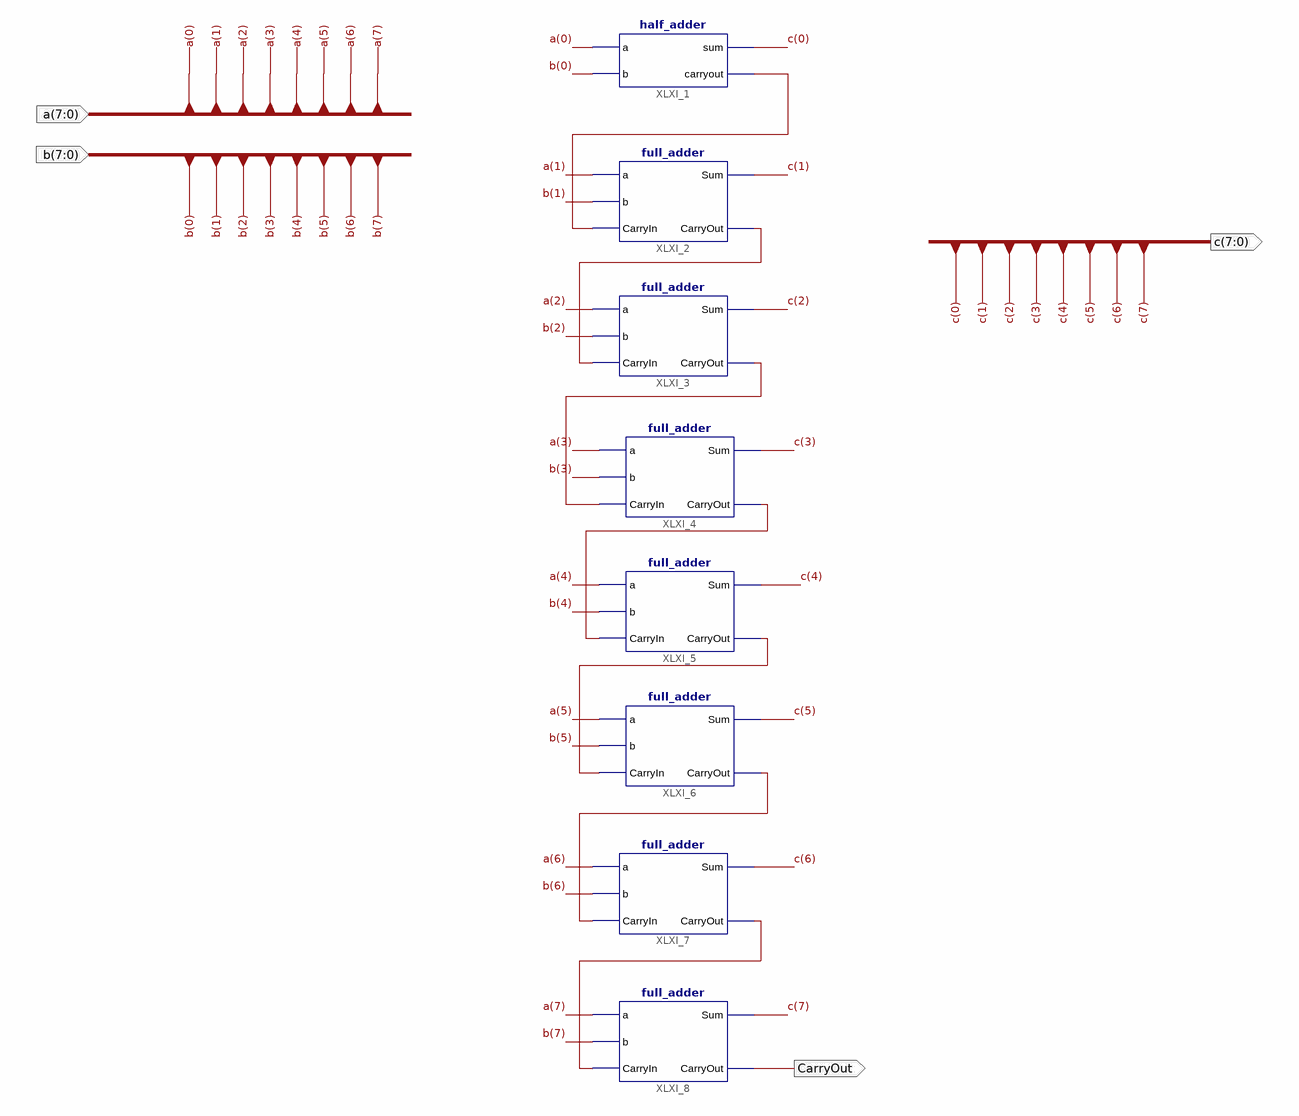
[diagram p0: schematic sheet 1]
// Xilinx ISE schematic eight_bit_adder.sch (spartan6) as structural Verilog: 8 symbols, 4 ports
module eight_bit_adder (
  input  [7:0] a,
  input  [7:0] b,
  output [7:0] c,
  output CarryOut
);

  wire XLXN_60, XLXN_63, XLXN_65, XLXN_67, XLXN_69, XLXN_71, XLXN_73;

  half_adder XLXI_1 (.a(a[0]), .b(b[0]), .sum(c[0]), .carryout(XLXN_60));
  full_adder XLXI_2 (.a(a[1]), .b(b[1]), .CarryIn(XLXN_60), .Sum(c[1]), .CarryOut(XLXN_63));
  full_adder XLXI_3 (.a(a[2]), .b(b[2]), .CarryIn(XLXN_63), .Sum(c[2]), .CarryOut(XLXN_65));
  full_adder XLXI_4 (.a(a[3]), .b(b[3]), .CarryIn(XLXN_65), .Sum(c[3]), .CarryOut(XLXN_67));
  full_adder XLXI_5 (.a(a[4]), .b(b[4]), .CarryIn(XLXN_67), .Sum(c[4]), .CarryOut(XLXN_69));
  full_adder XLXI_6 (.a(a[5]), .b(b[5]), .CarryIn(XLXN_69), .Sum(c[5]), .CarryOut(XLXN_71));
  full_adder XLXI_7 (.a(a[6]), .b(b[6]), .CarryIn(XLXN_71), .Sum(c[6]), .CarryOut(XLXN_73));
  full_adder XLXI_8 (.a(a[7]), .b(b[7]), .CarryIn(XLXN_73), .Sum(c[7]), .CarryOut(CarryOut));
endmodule
